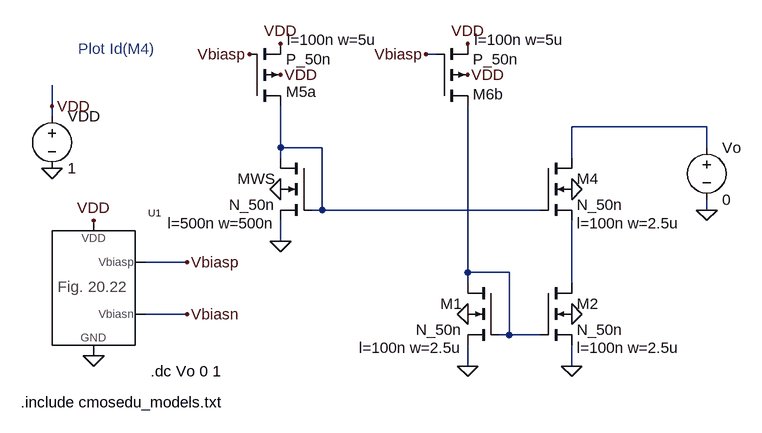
[diagram p0: schematic Fig20_37.asc]
Fig20_37.asc, the LTspice schematic file:
Version 4
SHEET 1 1580 680
WIRE 1040 -288 1024 -288
WIRE 448 -208 448 -240
WIRE 448 -192 448 -208
WIRE 1456 -176 1248 -176
WIRE 800 -144 800 -208
WIRE 864 -144 800 -144
WIRE 1456 -144 1456 -176
WIRE 800 -128 800 -144
WIRE 1248 -128 1248 -176
WIRE 864 -48 864 -144
WIRE 864 -48 848 -48
WIRE 1200 -48 864 -48
WIRE 1456 -48 1456 -64
WIRE 800 0 800 -32
WIRE 656 32 592 32
WIRE 1088 48 1088 -208
WIRE 1152 48 1088 48
WIRE 1088 64 1088 48
WIRE 1248 64 1248 -32
WIRE 656 112 592 112
WIRE 1152 144 1152 48
WIRE 1152 144 1136 144
WIRE 1200 144 1152 144
WIRE 1088 192 1088 160
WIRE 1248 192 1248 160
FLAG 448 -112 0
FLAG 448 -208 VDD
FLAG 512 -32 VDD
FLAG 512 176 0
FLAG 656 32 Vbiasp
FLAG 656 112 Vbiasn
FLAG 1248 112 0
FLAG 1248 192 0
FLAG 1456 -48 0
FLAG 800 -80 0
FLAG 800 0 0
FLAG 1088 112 0
FLAG 1088 192 0
FLAG 1248 -80 0
FLAG 800 -304 VDD
FLAG 752 -288 Vbiasp
FLAG 1088 -304 VDD
FLAG 1024 -288 Vbiasp
FLAG 800 -256 VDD
FLAG 1088 -256 VDD
SYMBOL voltage 448 -208 R0
WINDOW 123 0 0 Left 2
WINDOW 39 0 0 Left 2
SYMATTR InstName VDD
SYMATTR Value 1
SYMBOL nmos4 1200 64 R0
WINDOW 123 56 100 Left 2
SYMATTR Value2 l=100n w=2.5u
SYMATTR InstName M2
SYMATTR Value N_50n
SYMBOL voltage 1456 -160 R0
SYMATTR InstName Vo
SYMATTR Value 0
SYMBOL Fig_20_22 448 80 R0
SYMATTR InstName U1
SYMBOL nmos4 848 -128 M0
WINDOW 123 56 100 Left 2
SYMATTR Value2 l=500n w=500n
SYMATTR InstName MWS
SYMATTR Value N_50n
SYMBOL nmos4 1136 64 M0
WINDOW 123 56 100 Left 2
SYMATTR Value2 l=100n w=2.5u
SYMATTR InstName M1
SYMATTR Value N_50n
SYMBOL nmos4 1200 -128 R0
WINDOW 123 56 100 Left 2
SYMATTR Value2 l=100n w=2.5u
SYMATTR InstName M4
SYMATTR Value N_50n
SYMBOL pmos4 752 -208 M180
WINDOW 0 56 22 Left 2
WINDOW 123 58 102 Left 2
SYMATTR InstName M5a
SYMATTR Value2 l=100n w=5u
SYMATTR Value P_50n
SYMBOL pmos4 1040 -208 M180
WINDOW 0 56 18 Left 2
WINDOW 123 58 102 Left 2
SYMATTR InstName M6b
SYMATTR Value2 l=100n w=5u
SYMATTR Value P_50n
TEXT 400 248 Left 2 !.include cmosedu_models.txt
TEXT 488 -296 Left 2 ;Plot Id(M4)
TEXT 600 200 Left 2 !.dc Vo 0 1

The netlist it stands for:
* Fig20_37.asc
VDD VDD 0 1
M2 N004 N003 0 0 N_50n l=100n w=2.5u
Vo N001 0 0
XU1 Vbiasn Vbiasp VDD 0 Fig_20_22  ; pins Vbiasn Vbiasp VDD GND
MWS N002 N002 0 0 N_50n l=500n w=500n
M1 N003 N003 0 0 N_50n l=100n w=2.5u
M4 N001 N002 N004 0 N_50n l=100n w=2.5u
M5a N002 Vbiasp VDD VDD P_50n l=100n w=5u
M6b N003 Vbiasp VDD VDD P_50n l=100n w=5u
.model NMOS NMOS
.model PMOS PMOS
.lib standard.mos
.include cmosedu_models.txt
* Plot Id(M4)
.dc Vo 0 1
.backanno
.end